# Altium schematic sheet P1.schdoc
size 297 x 209 mm; Symbol: Drawing-Symbol_A4; Company: 嘉立创EDA; Version: V1.0; Page Size: A4; @Project Name: Watcher; @Update Date: 2026-03-16; @Create Date: 2026-03-16; Device: Drawing-Symbol_A4; @Board Name: Board1; @Page Name: P1; @Create Time: 18:32:03; @Page Count: 1; @Page No: 1; @Schematic Name: Schematic5; @Update Time: 18:32:03; @Assembly Variant: Basic; Border: 1; Title Block Position: 3; Size: A4; Width: 1170; Height: 825; Region Start: 1; X Region Count: 6; Y Region Count: 4; Blade Width: 10; Title Block: 1
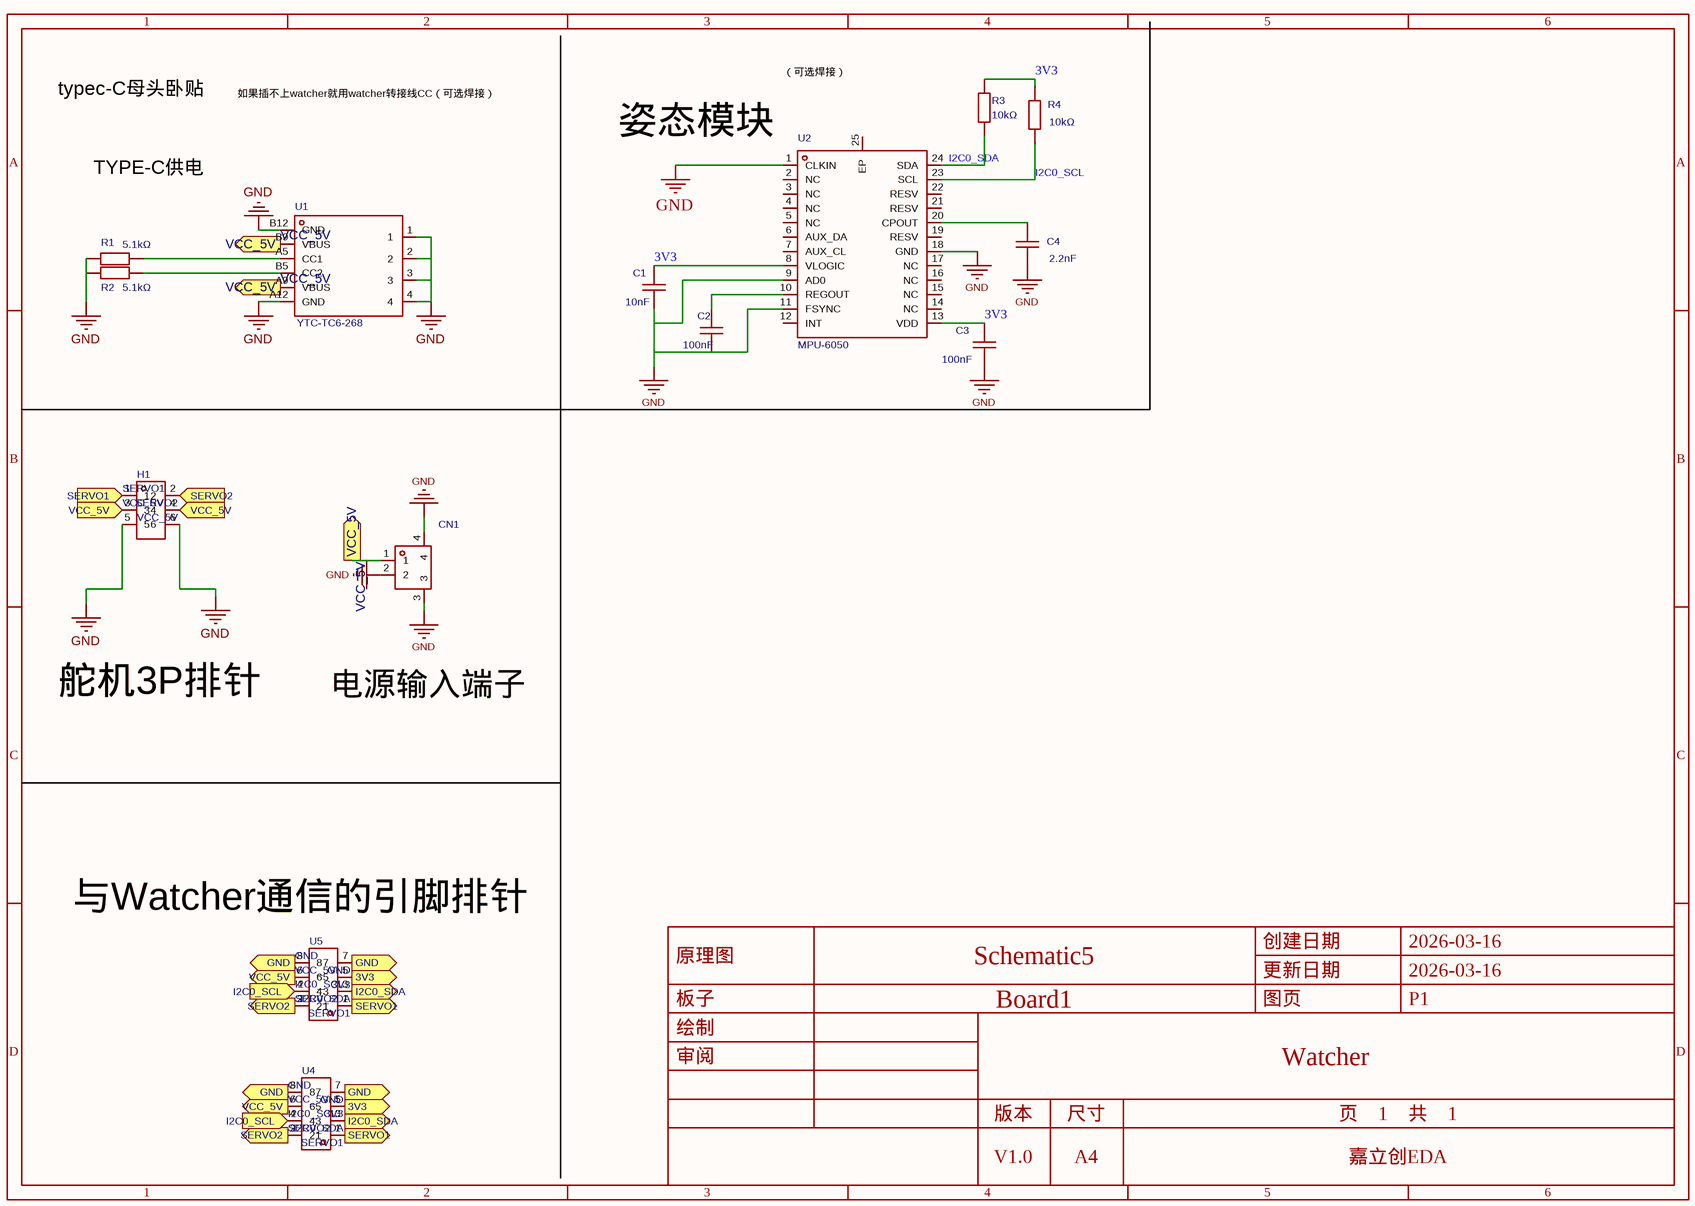
[diagram p0: P1.schdoc]

## Parts
C1  10nF  [C0603]
C2  100nF  [C0603]
C3  100nF  [C0603]
C4  2.2nF  [C0603]
CN1  SH1.0mm立式  [CONN-SMD_2P-P1.00_HC-1.0-2PLT]  (value not drawn)
H1  PZ254V-12-6P  [HDR-TH_6P-P2.54-V-M-R2-C3-S2.54]  (value not drawn)
R1  5.1kΩ  [R0603_1]
R2  5.1kΩ  [R0603_1]
R3  10kΩ  [R0603]
R4  10kΩ  [R0603]
U1  YTC-TC6-268  [TYPE-C-SMD_YIYUAN_YTC-TC6-268]
U2  MPU-6050  [QFN-24_L4.0-W4.0-P0.50-BL-EP2.7]
U4  PZ2.54-2*4  [HDR-TH_8P-P2.54-V-M-R2-C4-S2.54]  (value not drawn)
U5  PZ2.54-2*4  [HDR-TH_8P-P2.54-V-M-R2-C4-S2.54]  (value not drawn)

## Ports
3V3 (out), GND (out), I2C0_SCL (in), I2C0_SDA (out), SERVO1 (in), SERVO1 (out), SERVO2 (in), SERVO2 (out), VCC_5V (in), VCC_5V (out)

## Nets
GND: C1.1 C2.1 C3.1 C4.1 CN1.2 CN1.3 CN1.4 H1.5 H1.6 R1.1 R2.1 U1.1 U1.2 U1.3 U1.4 U1.A12(GND) U1.B12(GND) U2.1(CLKIN) U2.9(AD0) U2.11(FSYNC) U2.18(GND) U4.7 U4.8 U5.7 U5.8 ; port GND
3V3: C1.2 C3.2 R3.2 R4.2 U2.8(VLOGIC) U2.13(VDD) U4.5 U5.5 ; port 3V3
I2C0_SCL: R4.1 U2.23(SCL) U4.4 U5.4 ; port I2C0_SCL
I2C0_SDA: R3.1 U2.24(SDA) U4.3 U5.3 ; port I2C0_SDA
SERVO1: H1.1 U4.1 U5.1 ; port SERVO1
SERVO2: H1.2 U4.2 U5.2 ; port SERVO2
VCC_5V: CN1.1 H1.3 H1.4 U1.A9(VBUS) U1.B9(VBUS) U4.6 U5.6 ; port VCC_5V
NetC2_2: C2.2 U2.10(REGOUT)
NetC4_2: C4.2 U2.20(CPOUT)
NetR1_2: R1.2 U1.A5(CC1)
NetR2_2: R2.2 U1.B5(CC2)

Not connected (* = marked no-connect by the designer): U2 2(NC) 3(NC) 4(NC) 5(NC) 6(AUX_DA) 7(AUX_CL) 12(INT) 14(NC) 15(NC) 16(NC) 17(NC) 19(RESV) 21(RESV) 22(RESV) 25(EP)

## Notes on the sheet
- （可选焊接）
- typec-C母头卧贴
- 如果插不上watcher就用watcher转接线CC（可选焊接）
- 姿态模块
- TYPE-C供电
- 舵机3P排针
- 电源输入端子
- (near U5) 与Watcher通信的引脚排针
- 1
- 2
- 3
- 4
- 5
- 6
- A
- B
- C
- 创建日期
- 2026-03-16
- 原理图
- 板子
- Schematic5
- Board1
- 更新日期
- 图页
- P1
- D
- 绘制
- 审阅
- Watcher
- 版本
- V1.0
- 尺寸
- A4
- 页    1    共    1
- 嘉立创EDA

## Library data of the parts
C1 = CC0603KRX7R9BB103: 容值:10nF;精度:±10%;额定电压:50V;材质(温度系数):X7R;; Manufacturer: YAGEO(国巨); Add into BOM: yes; 3D Model: ac125912035d415993ca9572d50418b1; 3D Model Transform: 62.992,31.496,0,0,0,0,0,0,0; Tolerance: ±10%; Voltage Rated: 50V; Temperature Coefficient: X7R; ModelName: C0603_L1.6-W0.8-H0.8; Device: CC0603KRX7R9BB103; Symbol: CC0603KRX7R9BB103; Convert to PCB: yes; LCSC Part Name: 10nF ±10% 50V; Supplier Footprint: 0603; Datasheet: https://atta.szlcsc.com/upload/public/pdf/source/20181008/C309510_22F155564471FAF6A489F7D68F34234E.pdf; Supplier: LCSC; Manufacturer Part: CC0603KRX7R9BB103; Value: 10nF; Supplier Part: C100042; FootprintName: C0603
C2 C3 = 0603B104K500NT: 容值:100nF;精度:±10%;额定电压:50V;材质(温度系数):X7R;; Manufacturer: FH(风华); Add into BOM: yes; 3D Model: ac125912035d415993ca9572d50418b1; 3D Model Transform: 62.992,31.496,0,0,0,0,0,0,0; Tolerance: ±10%; Voltage Rated: 50V; Temperature Coefficient: X7R; ModelName: C0603_L1.6-W0.8-H0.8; Device: 0603B104K500NT; Symbol: 0603B104K500NT; Convert to PCB: yes; LCSC Part Name: 100nF ±10% 50V; Supplier Footprint: 0603; Datasheet: https://atta.szlcsc.com/upload/public/pdf/source/20200305/C486355_26A10D38EF8C2A5C37091D0039909270.pdf; SupplierPart: C30926; ManufacturerPart: 0603B104K500NT; Supplier: LCSC; FootprintName: C0603; Value: 100nF
C4 = 0603B222K500NT: 容值:2.2nF;精度:±10%;额定电压:50V;材质(温度系数):X7R;; Manufacturer: FH(风华); Add into BOM: yes; 3D Model: ac125912035d415993ca9572d50418b1; 3D Model Transform: 62.992,31.496,0,0,0,0,0,0,0; Tolerance: ±10%; Voltage Rated: 50V; Temperature Coefficient: X7R; ModelName: C0603_L1.6-W0.8-H0.8; Device: 0603B222K500NT; Symbol: 0603B222K500NT; Convert to PCB: yes; LCSC Part Name: 2.2nF ±10% 50V; Supplier Part: C1604; Manufacturer Part: 0603B222K500NT; Supplier Footprint: 0603; JLCPCB Part Class: 基础库; Datasheet: https://atta.szlcsc.com/upload/public/pdf/source/20200305/C486355_26A10D38EF8C2A5C37091D0039909270.pdf; Supplier: LCSC; Value: 2.2nF; FootprintName: C0603
CN1 = SH1.0mm立式: AddInBom: yes; ModelId: 8405b8a69a194bdca835d8d435b003ba0819f05c4eef4c71ace90d822a990e87; ModelTransform: 170.3973,147.2438,0,0,0,0,0,-13.78,0; Symbol: SH1.0MM立式; Device: SH1.0mm立式; LCSC Part Name: SH1.0mm立式; SupplierPart: C9900005667; ManufacturerPart: SH1.0mm立式; Supplier Footprint: SH1.0-2P; JLCPCB Part Class: Extended Part; Supplier: LCSC; ConvertToPcb: yes; FootprintName: CONN-SMD_2P-P1.00_HC-1.0-2PLT; ModelName: CONN-SMD_2P-P1.00_HC-1.0-2PLT
H1 = PZ254V-12-6P: 插针结构:2x3P;间距:2.54mm;行距:2.54mm;圆针/方针:方针;安装类型:直插;排数:双排;总PIN位数:6P;额定电流:-;额定电压:-;配合针长度:6mm;塑高:2.5mm;端接针长度:3mm;触头材质:黄铜;触头镀层:-;工作温度范围:-40℃~+105℃;颜色:黑色;; Manufacturer: XFCN(兴飞); 3D Model: e22692306cbd4b5c8488f4142eed6b9c; 3D Model Transform: 300.3931,200,0,0,0,0,0,0,-118.11; Pin Structure: 2x3P; Pitch: 2.54mm; Circluar Pins/Square Pins: 方针; Check: false; AddInBom: yes; Symbol: PZ254V-12-6P; Device: PZ254V-12-6P; LCSC Part Name: 间距:2.54mm 2x3P 直插 方针; Supplier Part: C492420; Manufacturer Part: PZ254V-12-6P; Supplier Footprint: 插件,P=2.54mm; JLCPCB Part Class: 扩展库; Datasheet: https://atta.szlcsc.com/upload/public/pdf/source/20200309/C492420_BAECB307B001054C09D200388220EAE6.pdf; Supplier: LCSC; Row Spacing: 2.54mm; Mounting Type: 直插; Number of Rows: 双排; Number of Pins: 6P; Current Rating (Max): -; Voltage Rating (Max): -; Length of Mating Pin: 6mm; Insulation Height: 2.5mm; Length of End Connection Pin: 3mm; Contact Material: 黄铜; Contact Plating: -; Operating Temperature Range: -40℃~+105℃; Color: 黑色; ConvertToPcb: yes; FootprintName: HDR-TH_6P-P2.54-V-M-R2-C3-S2.54; ModelName: HDR-TH_6P-P2.54-V-M-R2-C3-S2.54
R1 R2 = 0603WAF5101T5E: 电阻类型:厚膜电阻;阻值:5.1kΩ;精度:±1%;功率:100mW;温度系数:±100ppm/;最大工作电压:75V;工作温度范围:-55~+155;; Manufacturer: UNI-ROYAL(厚声); Symbol: 0603WAF5101T5E_2; 3D Model: 6bd5cd867e9542ebae21caaf5d2d4c4d; 3D Model Transform: 31.8897,63.7794,0,90,0,0,0,0,0; Tolerance: ±1%; Power(Watts): 100mW; Overload Voltage (Max): 75V; AddInBom: yes; ModelName: R0603; Device: 0603WAF5101T5E; Temperature Coefficient: ±100ppm/; Operating Temperature Range: -55~+155; LCSC Part Name: 5.1kΩ ±1% 100mW; Supplier Part: C23186; Manufacturer Part: 0603WAF5101T5E; Supplier Footprint: 0603; JLCPCB Part Class: 基础库; Datasheet: https://atta.szlcsc.com/upload/public/pdf/source/20200306/C422600_1E6D84923E4A46A82E41ADD87F860B5C.pdf; Supplier: LCSC; Type: 厚膜电阻; Value: 5.1kΩ; ConvertToPcb: yes; FootprintName: R0603_1
R3 = RC0603FR-0710KL: 电阻类型:厚膜电阻;阻值:10kΩ;精度:±1%;功率:100mW;最大工作电压:75V;温度系数:±100ppm/℃;; Manufacturer: YAGEO(国巨); Add into BOM: yes; 3D Model: fc143cca1e79419f9cd78b61e9279f08; 3D Model Transform: 31.8897,63.7794,0,90,0,0,0,0,0; Tolerance: ±1%; Power(Watts): 100mW; Overload Voltage (Max): 75V; Device: RC0603FR-0710KL; Symbol: RC0603FR-0710KL; Convert to PCB: yes; LCSC Part Name: 厚膜电阻 10kΩ ±1% 100mW; Supplier Part: C98220; Manufacturer Part: RC0603FR-0710KL; Supplier Footprint: 0603; JLCPCB Part Class: 扩展库; Datasheet: https://atta.szlcsc.com/upload/public/pdf/source/20180927/C295883_E8D83085EA81BD7DE0B2B681138C15EE.pdf; Supplier: LCSC; Type: 厚膜电阻; Value: 10kΩ; Temperature Coefficient: ±100ppm/℃; Operating Temperature Range: -55℃~+155℃; FootprintName: R0603; ModelName: R0603
R4 = RC0603FR-0710KL: 电阻类型:厚膜电阻;阻值:10kΩ;精度:±1%;功率:100mW;最大工作电压:75V;温度系数:±100ppm/℃;; Manufacturer: YAGEO(国巨); 3D Model: fc143cca1e79419f9cd78b61e9279f08; 3D Model Transform: 31.8897,63.7794,0,90,0,0,0,0,0; Tolerance: ±1%; Power(Watts): 100mW; Overload Voltage (Max): 75V; AddInBom: yes; Device: RC0603FR-0710KL; Symbol: RC0603FR-0710KL; LCSC Part Name: 厚膜电阻 10kΩ ±1% 100mW; Supplier Part: C98220; Manufacturer Part: RC0603FR-0710KL; Supplier Footprint: 0603; JLCPCB Part Class: 扩展库; Datasheet: https://atta.szlcsc.com/upload/public/pdf/source/20180927/C295883_E8D83085EA81BD7DE0B2B681138C15EE.pdf; Supplier: LCSC; Type: 厚膜电阻; Value: 10kΩ; Temperature Coefficient: ±100ppm/℃; Operating Temperature Range: -55℃~+155℃; ConvertToPcb: yes; FootprintName: R0603; ModelName: R0603
U1 = YTC-TC6-268: 连接器类型:Type-C;公母:母座;触点数量:6;; Manufacturer: YIYUAN(怡远); 3D Model: 1d7009b8f1724e38b5608beb74744d7c; 3D Model Transform: 351.9678,271.653,0,0,0,0,0,-49.21,-39.37; Connector Type: Type-C; Gender: 母座; Number of Contacts: 6; AddInBom: yes; Symbol: YTC-TC6-268; Device: YTC-TC6-268; LCSC Part Name: Type-C 母座; Supplier Part: C5260484; Manufacturer Part: YTC-TC6-268; Supplier Footprint: SMD; JLCPCB Part Class: 扩展库; Datasheet: https://atta.szlcsc.com/upload/public/pdf/source/20221115/94102468E8C367463F1D717839C68408.pdf; Supplier: LCSC; ConvertToPcb: yes; FootprintName: TYPE-C-SMD_YIYUAN_YTC-TC6-268; ModelName: TYPE-C-SMD_YIYUAN_YTC-TC6-268
U2 = MPU-6050: 传感器类型:加速度计陀螺仪;; Manufacturer: TDK InvenSense(应美盛); Symbol: MPU-6050_C24112; 3D Model: 36587cbfa4eb4c959e87e8b9fcde8e46; 3D Model Transform: 158.267,158.267,0,0,0,0,-0.01,0,0; AddInBom: yes; ModelName: QFN-24_L4.0-W4.0-H0.9-P0.50-; Device: MPU-6050; LCSC Part Name: MPU-6050; Supplier Part: C24112; Manufacturer Part: MPU-6050; Supplier Footprint: QFN-24-EP(4x4); JLCPCB Part Class: 扩展库; Datasheet: https://atta.szlcsc.com/upload/public/pdf/source/20140425/1457707046159.pdf; Supplier: LCSC; Sensor Type: 加速度计陀螺仪; Operating Temperature: -40℃~+85℃; ConvertToPcb: yes; FootprintName: QFN-24_L4.0-W4.0-P0.50-BL-EP2.7
U4 U5 = PZ2.54-2*4: 插针结构:2x4P;间距:2.54mm;行距:2.54mm;圆针/方针:方针;安装方式:直插;排数:双排;总PIN位数:8P;额定电流:2.5A;配合针长度:6mm;塑高:2.54mm;端接针长度:3mm;触头材质:黄铜;触头镀层:金;工作温度:-40℃~+105℃;; Manufacturer: ZHOURI(洲日); AddInBom: yes; ModelId: 9655140a9899454ea9d6a6732d55fb0e0819f05c4eef4c71ace90d822a990e87; ModelName: HDR-TH_8P-P2.54-M-LI-2X4P; ModelTransform: 399.999,200,0,0,0,0,0,0,-118.11; Pin Structure: 2x4P; Pitch: 2.54mm; Circluar Pins/Square Pins: 方针; Current Rating: 2.5A; Symbol: PZ2.54-2*4; Device: PZ2.54-2*4; LCSC Part Name: 2x4P 间距:2.54mm 方针 直插; SupplierPart: C5156676; ManufacturerPart: PZ2.54-2*4; Supplier Footprint: 插件,P=2.54mm; JLCPCB Part Class: Extended Part; Datasheet: https://item.szlcsc.com/datasheet/PZ2.54-2*4/5790845.html; Supplier: LCSC; ConvertToPcb: yes; FootprintName: HDR-TH_8P-P2.54-V-M-R2-C4-S2.54; Row Spacing: 2.54mm; Mounting Type: 直插; Number of Rows: 双排; Number of Pins: 8P; Length of Mating Pin: 6mm; Insulation Height: 2.54mm; Length of End Connection Pin: 3mm; Contact Material: 黄铜; Contact Plating: 金; Operating Temperature: -40℃~+105℃